# Altium schematic sheet USB_CONNECTOR.SchDoc
size Letter; SheetNumber: 9; SheetTotal: 15
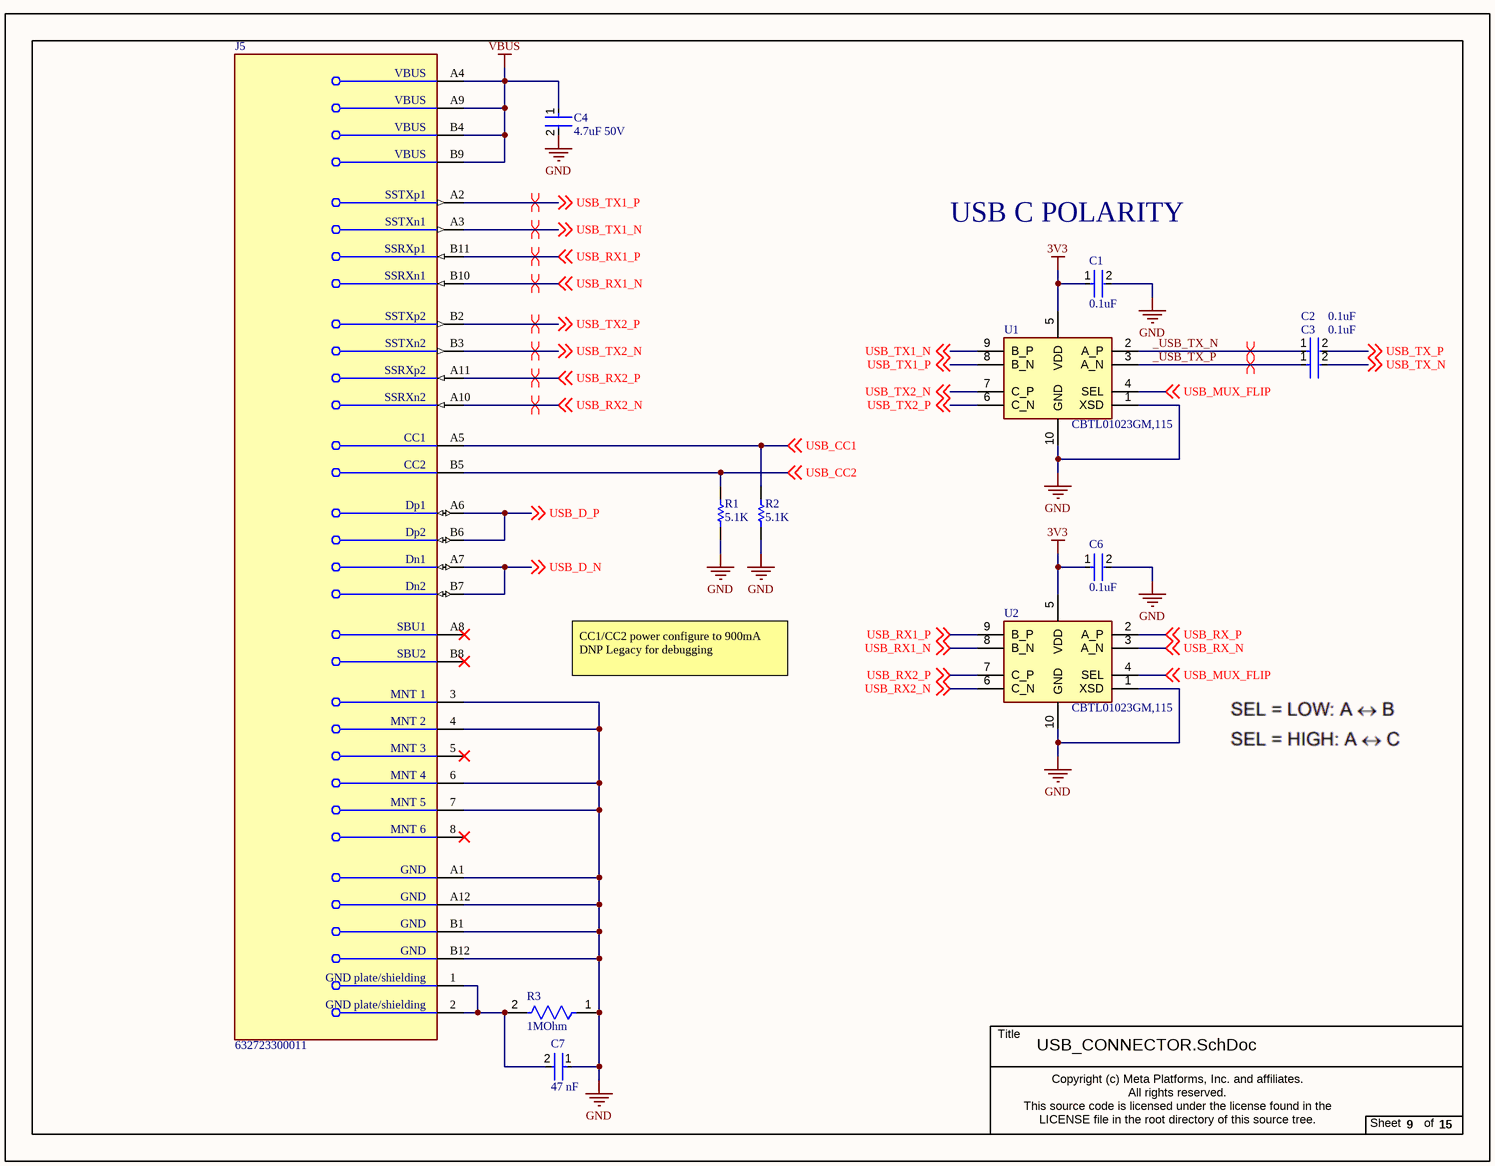
[diagram p0: USB_CONNECTOR.SchDoc]

## Parts
C1  0.1uF  [FP-CC0201-BA-MFG]
C2  0.1uF  [FP-CC0201-BA-MFG]
C3  0.1uF  [FP-CC0201-BA-MFG]
C4  4.7uF 50V  [FP-C2012-125-0_2-IPC_B]
C6  0.1uF  [FP-CC0201-BA-MFG]
C7  47 nF  [FP-CC0402-MFG]
J5  632723300011  [FP-632723300011-MFG]
R1  5.1K  [RESC1005X40X25NL05T10]
R2  5.1K  [RESC1005X40X25NL05T10]
R3  1MOhm  [FP-RMCF0402-MFG]
U1  CBTL01023GM,115  [QFN50P200X155X50-10N]
U2  CBTL01023GM,115  [QFN50P200X155X50-10N]

## Nets
3V3: C1.1 C6.1 U1.5(VDD) U2.5(VDD)
GND: C1.2 C4.2 C6.2 C7.1 J5.3(MNT_1) J5.4(MNT_2) J5.6(MNT_4) J5.7(MNT_5) J5.A1(GND) J5.A12(GND) J5.B1(GND) J5.B12(GND) R1.1 R2.1 R3.1 U1.1(XSD) U1.10(GND) U2.1(XSD) U2.10(GND)
VBUS: C4.1 J5.A4(VBUS) J5.A9(VBUS) J5.B4(VBUS) J5.B9(VBUS)
_USB_TX_N: C2.1 U1.2(A_P)
_USB_TX_P: C3.1 U1.3(A_N)
USB_CC1: J5.A5(CC1) R2.2 ; off-sheet USB_CC1
USB_CC2: J5.B5(CC2) R1.2 ; off-sheet USB_CC2
USB_D_N: J5.A7(Dn1) J5.B7(Dn2) ; off-sheet USB_D_N
USB_D_P: J5.A6(Dp1) J5.B6(Dp2) ; off-sheet USB_D_P
USB_MUX_FLIP: U1.4(SEL) U2.4(SEL) ; off-sheet USB_MUX_FLIP
USB_RX1_N: J5.B10(SSRXn1) U2.8(B_N) ; off-sheet USB_RX1_N
USB_RX1_P: J5.B11(SSRXp1) U2.9(B_P) ; off-sheet USB_RX1_P
USB_RX2_N: J5.A10(SSRXn2) U2.6(C_N) ; off-sheet USB_RX2_N
USB_RX2_P: J5.A11(SSRXp2) U2.7(C_P) ; off-sheet USB_RX2_P
USB_RX_N: U2.3(A_N) ; off-sheet USB_RX_N
USB_RX_P: U2.2(A_P) ; off-sheet USB_RX_P
USB_TX1_N: J5.A3(SSTXn1) U1.9(B_P) ; off-sheet USB_TX1_N
USB_TX1_P: J5.A2(SSTXp1) U1.8(B_N) ; off-sheet USB_TX1_P
USB_TX2_N: J5.B3(SSTXn2) U1.7(C_P) ; off-sheet USB_TX2_N
USB_TX2_P: J5.B2(SSTXp2) U1.6(C_N) ; off-sheet USB_TX2_P
USB_TX_N: C3.2 ; off-sheet USB_TX_N
USB_TX_P: C2.2 ; off-sheet USB_TX_P
NetC7_2: C7.2 J5.1(GND_plate/shielding) J5.2(GND_plate/shielding) R3.2

Not connected (* = marked no-connect by the designer): J5 5(MNT_3)* 8(MNT_6)* A8(SBU1)* B8(SBU2)*

## Layout directives
differential pair: _USB_TX_N, _USB_TX_P, USB_RX1_N, USB_RX1_P, USB_RX2_N, USB_RX2_P, USB_TX1_N, USB_TX1_P, USB_TX2_N, USB_TX2_P

## Notes on the sheet
- USB C POLARITY
- CC1/CC2 power configure to 900mA
  DNP Legacy for debugging
- Title
- Copyright (c) Meta Platforms, Inc. and affiliates.
  All rights reserved.
  This source code is licensed under the license found in the
  LICENSE file in the root directory of this source tree.
- Sheet
- of

## Library data of the parts
C1-C3 C6 = CMP-03422-000376-1: CAP CER 0.1UF 6.3V X5R 0201; Manufacturer: Yageo; Manufacturer Part Number: CC0201KRX5R5BB104; Tolerance: 0.1; Temperature Coefficient: 15%; Value: 100 nF; Material: Ceramic; Automotive: No; Device Class L2: Capacitors; Temperature Range High: +85°C; Capacitance: 100 nF; Temperature: -55°C to +85°C; ComponentLink2URL: http://www.yageo.com/documents/recent/UPY-GPHC_X5R_4V-to-50V_25.pdf; Category: Cap; Mouser Description: Multilayer Ceramic Capacitors MLCC - SMD/SMT 100nF 6.3V X5R 10%; Ipc Land Pattern Name: CAPC6030X30; Temperature Characteristic: X5R; Voltage Rating: 6.3 V; Lead Free: Yes; Digikey Description: CAP CER 0.1UF 6.3V X5R 0201; Device Class L1: Passive Components; Octopart: https://octopart.com/cc0201krx5r5bb104-yageo-9292636; Height: 0.33mm; Package: CC0201-BA; Footprint Url: http://www.yageo.com/exep/pages/download/literatures/UPY-C_GEN_24.pdf; ComponentLink2Description: Datasheet; Device Class L3: Ceramic Capacitors; Temperature Range Low: -55°C; RoHS: TRUE
C4 = CMP-08246-000007-2: Multilayer Ceramic Capacitors 4.7μF ±10% 50V X5R SMD 0805; Case Code (Metric): 2012; Weight: 0.000194oz; Voltage Rating: 50V; Voltage: 50V; Construction: Flat; Series: C; Packaging: Tape and Reel; Height: 1.25mm; Depth: 1.25mm; Resistor Type: Ceramic; Width: 0.049inch; Length: 2mm; Thickness: 0.057inch; REACH SVHC: No SVHC; Max Operating Temperature: 85°C; Case/Package: 0805; Capacitance: 4.7uF; Dielectric: X5R; Tolerance: 10%; Dielectric Material: Ceramic; Package Quantity: 1; Mount: Surface Mount; Radiation Hardening: No; Voltage Rating (DC): 50V; Case Code (Imperial): 0805; Termination: SMD/SMT; Min Operating Temperature: -55°C; Lead Free: Lead Free
C7 = CMP-03422-000813-1: CAP CER 0.047UF 25V X7R 0402; Manufacturer Part Number: CC0402KRX7R8BB473; Manufacturer: YAGEO; Automotive Grade: NA; Temperature Coefficient: 30ppm/°C; Material: Ceramic; Tolerance: 0.1; Temperature: -55°C to +125°C; Category: Cap; Voltage Rating: 25 V; Digikey Description: CAP CER 0.047UF 25V X7R 0402; Device Class L1: Passive Components; Device Class L3: Ceramic Capacitors; Ipc Land Pattern Name: CAPC10050X50; Value: 47 nF; Temperature Characteristic: X7R; Temperature Range High: +125°C; ComponentLink2URL: http://www.yageo.com/documents/recent/UPY-GP_NP0_16V-to-50V_16.pdf; Automotive: No; Temperature Range Low: -55°C; Package: CC0402; RoHS: TRUE; Height: 0.55mm; Device Class L2: Capacitors; Capacitance: 47 nF; Octopart: https://octopart.com/cc0402krx7r8bb473-yageo-22850998; Lead Free: Yes; Mouser Description: Multilayer Ceramic Capacitors MLCC - SMD/SMT 47nF 25V X7R 10%; Footprint Url: http://www.yageo.com/exep/pages/download/literatures/UPY-C_GEN_24.pdf; ComponentLink2Description: Datasheet
J5 = CMP-1502-03214-2: CONN RCP USB3.1 TYPEC 24P SMD RA; Number of Ports: 1; Connector Type: USB; Mating Cycles: 10000; Number of Contacts: 24; Gender: Receptacle; Shielding: Unshielded; RoHS Compliant: Yes; Mount: Surface Mount; Termination: Solder; Min Operating Temperature: -40°C; Packaging: Cut Tape; Contact Plating: Gold; Max Operating Temperature: 105°C; Flammability Rating: UL94 V-0; Insulation Color: Black; Series: -
R1 R2 = CMP-2002-07753-1: Part Number: RC0402FR-075K1L; Manufacturer: Yageo / Phycomp
R3 = CMP-2000-06985-2: 1MΩ ±1% 0.063W 0402 Thick Film Chip Resistor AEC-Q200 compliant; Max Power Dissipation: 63mW; Resistance: 1MR; Power Rating: 62.5mW; Temperature Coefficient: 100ppm/°C; Resistor Type: Thick Film; Military Standard: Not; Packaging: Tape and Reel; Radiation Hardening: No; Construction: Rectangular; Length: 1mm; Case/Package: 0402; Width: 0.02inch; Case Code (Imperial): 0402; Lead Free: Lead Free; Number of Terminations: 2; Min Operating Temperature: -55°C; Height: 0.016inch; Tolerance: 1%; Contact Plating: Tin; Case Code (Metric): 1005; Depth: 0.5mm; Features: Automotive AEC-Q200; Max Operating Temperature: 155°C; Size Code: 0402; Mount: Surface Mount; RoHS Compliant: Yes; Series: RMCF
U1 U2 = CBTL01023GM,115: DisplayPort, PCIe, USB Switch IC 1 Channel 10-XQFN (1.55x2); Manufacturer: NXP USA Inc.; Part Number: CBTL01023GM,115